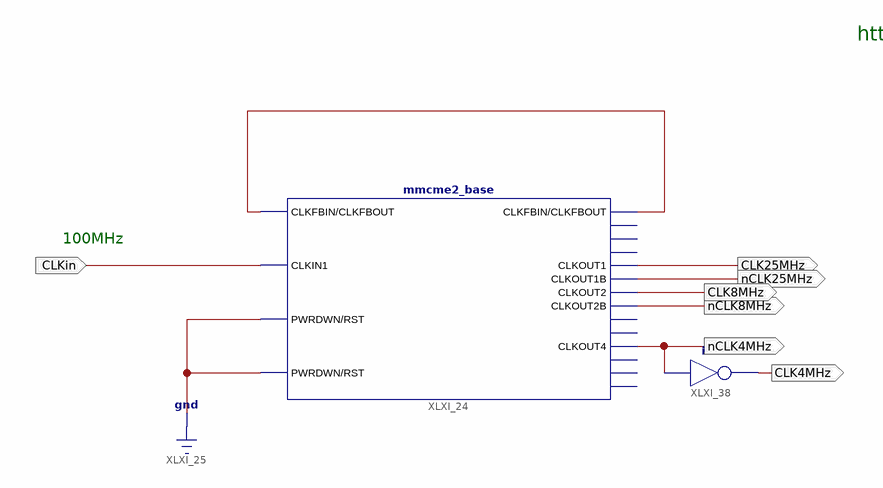
[diagram p0: schematic sheet 1]
// Xilinx ISE schematic divideby6.sch (artix7) as structural Verilog: 2 symbols, 7 ports
module divideby6 (
  input  CLKin,
  output CLK25MHz,
  output nCLK25MHz,
  output nCLK4MHz,
  output CLK4MHz,
  output nCLK8MHz,
  output CLK8MHz
);

  wire XLXN_74;

  mmcme2_base #(.CLKOUT2_DIVIDE(96), .CLKOUT1_DIVIDE(32), .CLKOUT0_DIVIDE_F(48), .CLKFBOUT_MULT_F(8), .CLKOUT3_DIVIDE(1), .CLKOUT6_DIVIDE(48), .CLKOUT4_DIVIDE(4), .CLKOUT4_CASCADE("TRUE"), .DIVCLK_DIVIDE(1), .CLKOUT1_PHASE(0.000), .CLKOUT4_PHASE(0)) XLXI_24 (
    .CLKFBIN(XLXN_74), .CLKIN1(CLKin), .PWRDWN(1'b0), .RST(1'b0), .CLKFBOUT(XLXN_74), .CLKOUT1(CLK25MHz),
    .CLKOUT1B(nCLK25MHz), .CLKOUT2(CLK8MHz), .CLKOUT2B(nCLK8MHz), .CLKOUT4(nCLK4MHz));  // open: CLKFBOUTB, CLKOUT0, CLKOUT0B, CLKOUT3, CLKOUT3B, CLKOUT5, CLKOUT6, LOCKED
  not XLXI_38 (CLK4MHz, nCLK4MHz);

  // Notes on the sheet:
  //   http://www.hitequest.com/Hardware/a120.htm
  //   100MHz
endmodule
